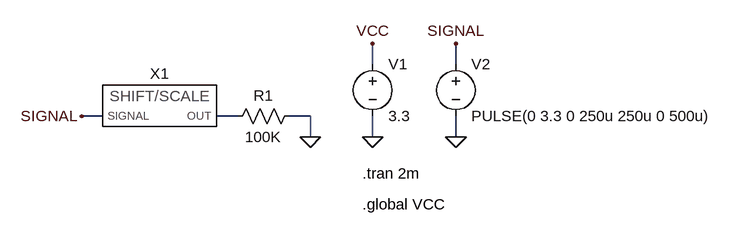
[diagram p0: schematic test_shift_scale.asc]
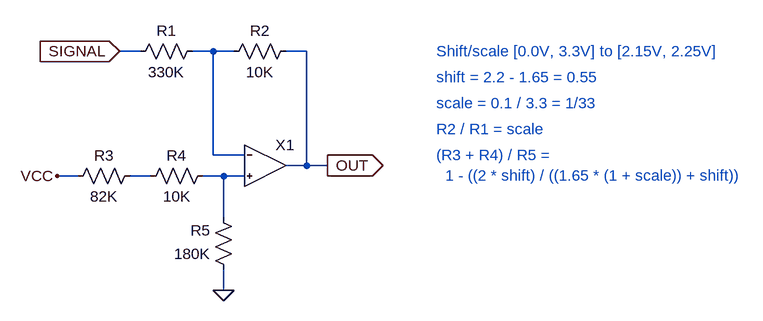
[diagram p1: sub-circuit shift_scale.asc]
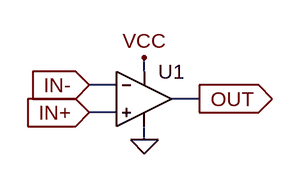
[diagram p2: sub-circuit opamp.asc]
test_shift_scale.asc, the LTspice schematic file:
Version 4
SHEET 1 1908 768
WIRE 1040 240 1040 208
WIRE 1168 240 1168 208
WIRE 624 320 592 320
WIRE 832 320 800 320
WIRE 944 320 912 320
WIRE 944 352 944 320
WIRE 1040 352 1040 320
WIRE 1168 352 1168 320
FLAG 1040 352 0
FLAG 1040 208 VCC
FLAG 1168 352 0
FLAG 1168 208 SIGNAL
FLAG 592 320 SIGNAL
FLAG 944 352 0
SYMBOL voltage 1040 224 R0
WINDOW 123 0 0 Left 0
WINDOW 39 0 0 Left 0
SYMATTR InstName V1
SYMATTR Value 3.3
SYMBOL voltage 1168 224 R0
WINDOW 123 0 0 Left 0
WINDOW 39 0 0 Left 0
SYMATTR InstName V2
SYMATTR Value PULSE(0 3.3 0 250u 250u 0 500u)
SYMBOL shift_scale 688 272 R0
SYMATTR InstName X1
SYMBOL res 928 304 R90
WINDOW 0 0 56 VBottom 2
WINDOW 3 32 56 VTop 2
SYMATTR InstName R1
SYMATTR Value 100K
TEXT 1024 408 Left 2 !.tran 2m
TEXT 1024 456 Left 2 !.global VCC

shift_scale.asc, the sub-circuit schematic file:
Version 4
SHEET 1 1260 680
WIRE 64 0 32 0
WIRE 176 0 144 0
WIRE 208 0 176 0
WIRE 320 0 288 0
WIRE 176 160 176 0
WIRE 224 160 176 160
WIRE 320 176 320 0
WIRE 320 176 288 176
WIRE 352 176 320 176
WIRE -32 192 -64 192
WIRE 80 192 48 192
WIRE 192 192 160 192
WIRE 224 192 192 192
WIRE 192 256 192 192
WIRE 192 368 192 336
FLAG -64 192 VCC
FLAG 32 0 SIGNAL
IOPIN 32 0 In
FLAG 192 368 0
FLAG 352 176 OUT
IOPIN 352 176 Out
SYMBOL res 208 352 R180
WINDOW 0 36 76 Left 2
WINDOW 3 36 40 Left 2
SYMATTR InstName R5
SYMATTR Value 180K
SYMBOL res 64 208 R270
WINDOW 0 32 56 VTop 2
WINDOW 3 0 56 VBottom 2
SYMATTR InstName R4
SYMATTR Value 10K
SYMBOL res 304 -16 R90
WINDOW 0 0 56 VBottom 2
WINDOW 3 32 56 VTop 2
SYMATTR InstName R2
SYMATTR Value 10K
SYMBOL res 160 -16 R90
WINDOW 0 0 56 VBottom 2
WINDOW 3 32 56 VTop 2
SYMATTR InstName R1
SYMATTR Value 330K
SYMBOL res 64 176 R90
WINDOW 0 0 56 VBottom 2
WINDOW 3 32 56 VTop 2
SYMATTR InstName R3
SYMATTR Value 82K
SYMBOL opamp 256 176 R0
SYMATTR InstName X1
TEXT 520 0 Left 2 ;Shift/scale [0.0V, 3.3V] to [2.15V, 2.25V]
TEXT 520 40 Left 2 ;shift = 2.2 - 1.65 = 0.55
TEXT 520 80 Left 2 ;scale = 0.1 / 3.3 = 1/33
TEXT 520 120 Left 2 ;R2 / R1 = scale
TEXT 520 160 Left 2 ;(R3 + R4) / R5 =\n  1 - ((2 * shift) / ((1.65 * (1 + scale)) + shift))

opamp.asc, the sub-circuit schematic file:
Version 4
SHEET 1 880 680
WIRE 144 144 144 128
WIRE 112 160 80 160
WIRE 208 176 176 176
WIRE 112 192 80 192
WIRE 144 224 144 208
FLAG 144 224 0
FLAG 144 128 VCC
FLAG 208 176 OUT
IOPIN 208 176 Out
FLAG 80 192 IN+
IOPIN 80 192 In
FLAG 80 160 IN-
IOPIN 80 160 In
SYMBOL Opamps\\UniversalOpamp2 144 176 R0
SYMATTR InstName U1
SYMATTR Value2 Avol=1Meg GBW=1.2Meg Slew=10Meg

The netlist it stands for:
* test_shift_scale.asc
V1 VCC 0 3.3
V2 SIGNAL 0 PULSE(0 3.3 0 250u 250u 0 500u)
XX1 SIGNAL N001 shift_scale
R1 0 N001 100K

* block symbol definitions
.subckt shift_scale SIGNAL OUT
R5 0 N003 180K
R4 N002 N003 10K
R2 OUT N001 10K
R1 N001 SIGNAL 330K
R3 N002 VCC 82K
XX1 N003 N001 OUT opamp
* Shift/scale [0.0V, 3.3V] to [2.15V, 2.25V]
* shift = 2.2 - 1.65 = 0.55
* scale = 0.1 / 3.3 = 1/33
* R2 / R1 = scale
* (R3 + R4) / R5 =
*   1 - ((2 * shift) / ((1.65 * (1 + scale)) + shift))
.ends shift_scale

.subckt opamp IN+ IN- OUT
XU1 IN+ IN- VCC 0 OUT level.2 Avol=1Meg GBW=1.2Meg Slew=10Meg ilimit=25m rail=0 Vos=0 phimargin=45 en=0 enk=0 in=0 ink=0 Rin=500Meg  ; pins IN+ IN- V+ V- OUT
.ends opamp

.tran 2m
.global VCC
.lib UniversalOpamps2.sub
.backanno
.end